# EAGLE schematic contra1575 (EAGLE 7.5.0)
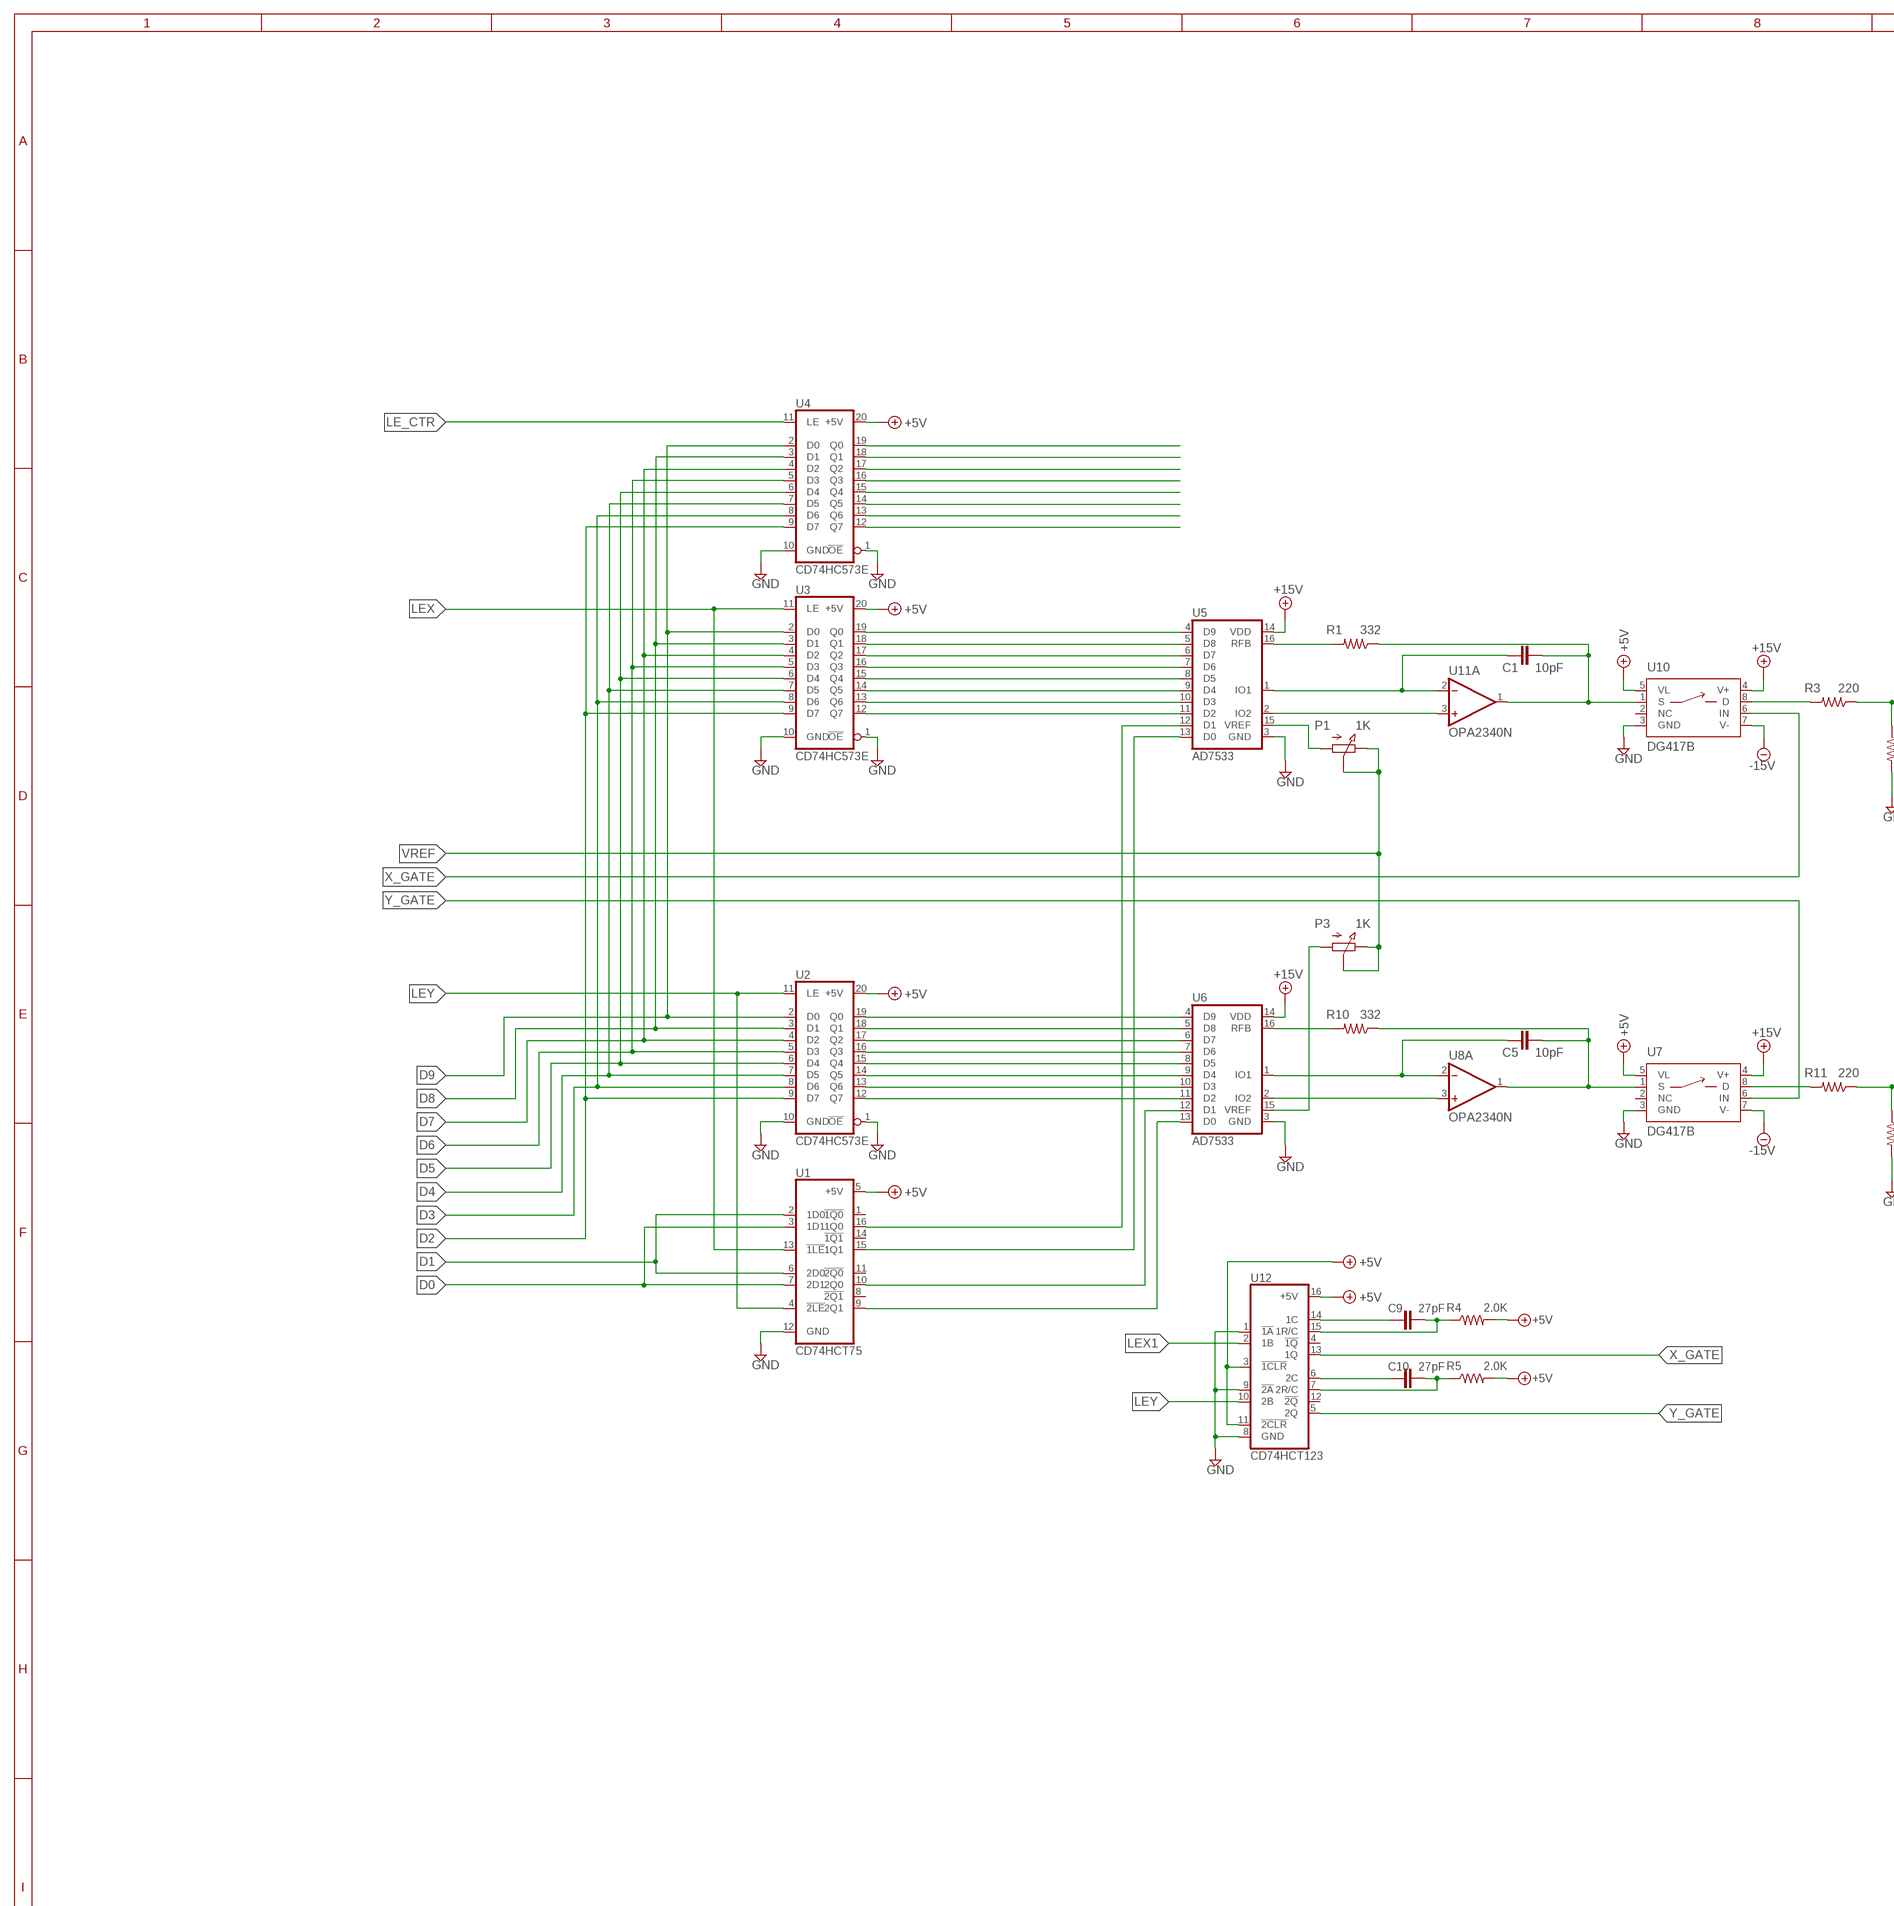
[diagram p0: schematic, sheet 1, part 1 of 2]
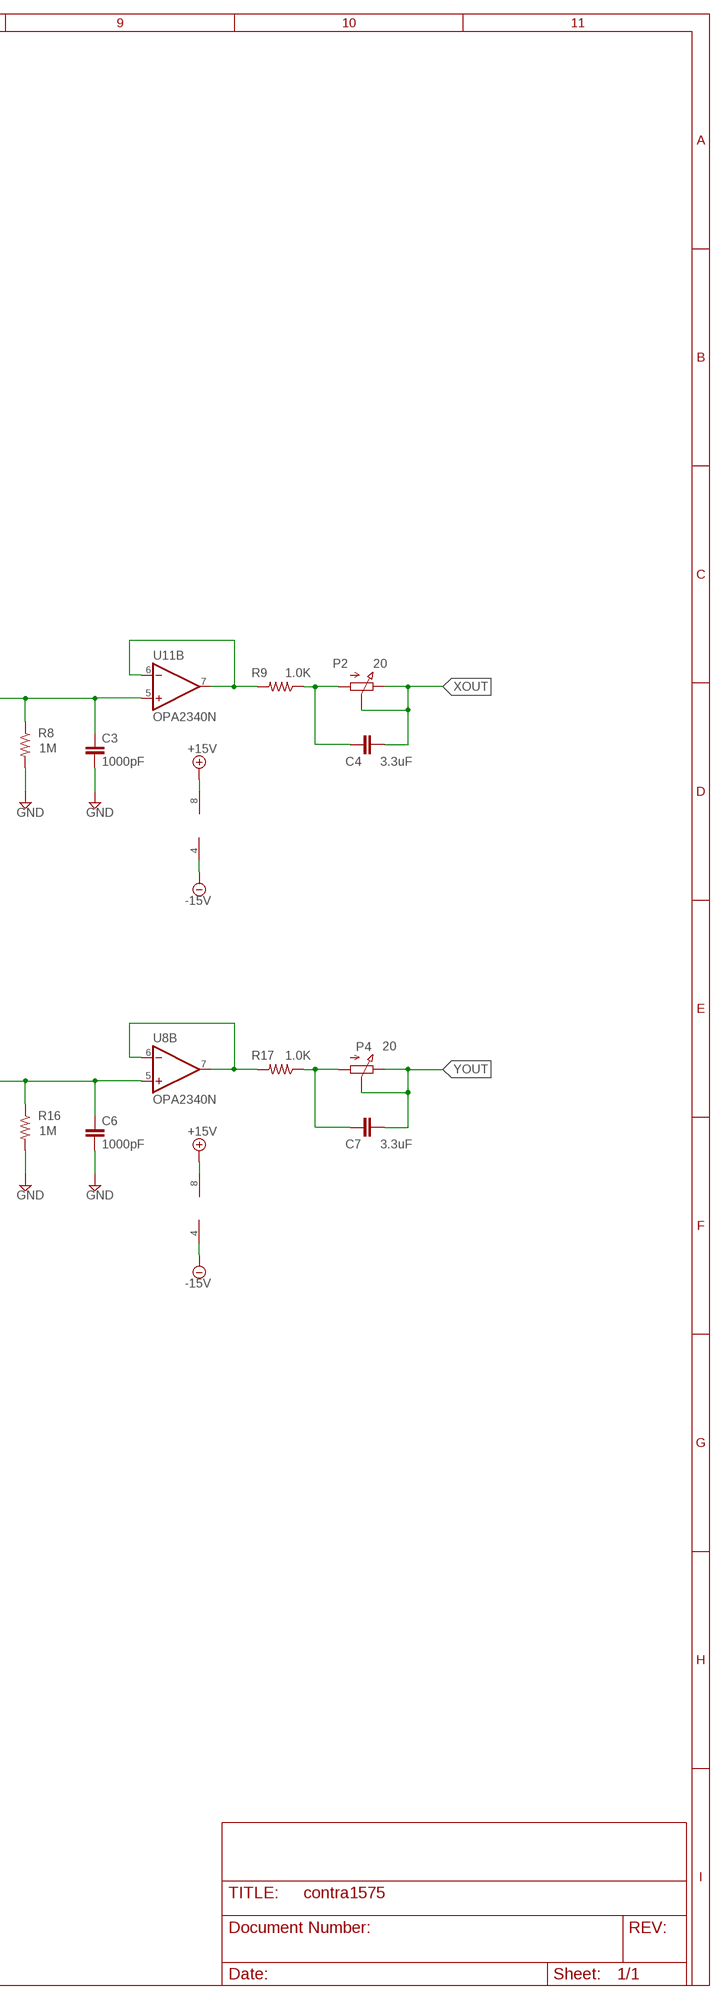
[diagram p1: schematic, sheet 1, part 2 of 2]

## Parts
C1  10pF  C-0.1  [C2.5]
C3  1000pF  C-0.1  [C2.5]
C4  3.3uF  MKS2B043301H00  [MKS2B043301H00]
C5  10pF  C-0.1  [C2.5]
C6  1000pF  C-0.1  [C2.5]
C7  3.3uF  MKS2B043301H00  [MKS2B043301H00]
C9  27pF  C-0.1  [C2.5]
C10  27pF  C-0.1  [C2.5]
P1  1K  POT-3006P  [3006P]
P2  20  POT-3006P  [3006P]
P3  1K  POT-3006P  [3006P]
P4  20  POT-3006P  [3006P]
R1  332  R-1/4WATT  [0207/10]
R3  220  R-1/4WATT  [0207/10]
R4  2.0K  R-1/4WATT  [0207/10]
R5  2.0K  R-1/4WATT  [0207/10]
R8  1M  R-1/4WATT  [0207/10]
R9  1.0K  R-1/4WATT  [0207/10]
R10  332  R-1/4WATT  [0207/10]
R11  220  R-1/4WATT  [0207/10]
R16  1M  R-1/4WATT  [0207/10]
R17  1.0K  R-1/4WATT  [0207/10]
U1  CD74HCT75  [DIP-16]
U2  CD74HC573E  [DIP-20]
U3  CD74HC573E  [DIP-20]
U4  CD74HC573E  [DIP-20]
U5  AD7533  [DIP-16]
U6  AD7533  [DIP-16]
U7  DG417B  [DIP-08]
U8  OPA2340N  [DIP-08]
U10  DG417B  [DIP-08]
U11  OPA2340N  [DIP-08]
U12  CD74HCT123  [DIP-16]

## Nets
+5V: R4.2 R5.2 U1.5(+5V) U2.20(+5V) U3.20(+5V) U4.20(+5V) U7.5(VL) U10.5(VL) U12.3(!1CLR) U12.11(!2CLR) U12.16(+5V)
+15V: U5.14(VDD) U6.14(VDD) U7.4(V+) U8.8(P:V+) U10.4(V+) U11.8(P:V+)
-15V: U7.7(V-) U8.4(P:V-) U10.7(V-) U11.4(P:V-)
D0: U1.3(1D1) U1.7(2D1)
D1: U1.2(1D0) U1.6(2D0)
D2: U2.9(D7) U3.9(D7) U4.9(D7)
D3: U2.8(D6) U3.8(D6) U4.8(D6)
D4: U2.7(D5) U3.7(D5) U4.7(D5)
D5: U2.6(D4) U3.6(D4) U4.6(D4)
D6: U2.5(D3) U3.5(D3) U4.5(D3)
D7: U2.4(D2) U3.4(D2) U4.4(D2)
D8: U2.3(D1) U3.3(D1) U4.3(D1)
D9: U2.2(D0) U3.2(D0) U4.2(D0)
GND: C3.2 C6.2 R8.2 R16.2 U1.12(GND) U2.1(!OE) U2.10(GND) U3.1(!OE) U3.10(GND) U4.1(!OE) U4.10(GND) U5.3(GND) U6.3(GND) U7.3(GND) U10.3(GND) U12.1(!1A) U12.8(GND) U12.9(!2A)
LE_CTR: U4.11(LE)
LEX: U1.13(!1LE) U3.11(LE)
LEX1: U12.2(1B)
LEY: U1.4(!2LE) U2.11(LE)
LEY1: U12.10(2B)
N$1: R9.2 U11.6(B:-IN) U11.7(B:OUT)
N$2: C9.2 R4.1 U12.15(1R/C)
N$3: U1.16(1Q0) U5.12(D1)
N$4: U1.15(1Q1) U5.13(D0)
N$5: C1.1 U5.1(IO1) U11.2(A:-IN)
N$6: U5.2(IO2) U11.3(A:+IN)
N$7: U2.19(Q0) U6.4(D9)
N$8: U2.18(Q1) U6.5(D8)
N$9: U2.17(Q2) U6.6(D7)
N$10: U2.16(Q3) U6.7(D6)
N$11: U2.15(Q4) U6.8(D5)
N$12: U2.14(Q5) U6.9(D4)
N$13: U2.13(Q6) U6.10(D3)
N$14: U2.12(Q7) U6.11(D2)
N$15: U4.12(Q7)
N$16: U4.13(Q6)
N$17: U4.14(Q5)
N$18: U4.15(Q4)
N$19: U4.16(Q3)
N$20: U4.17(Q2)
N$21: U4.18(Q1)
N$22: U4.19(Q0)
N$23: C1.2 R1.1 U10.1(S) U11.1(A:OUT)
N$24: P1.1(A) U5.15(VREF)
N$25: U3.19(Q0) U5.4(D9)
N$26: U3.18(Q1) U5.5(D8)
N$27: U3.17(Q2) U5.6(D7)
N$28: U3.16(Q3) U5.7(D6)
N$29: U3.15(Q4) U5.8(D5)
N$30: U3.14(Q5) U5.9(D4)
N$31: U3.13(Q6) U5.10(D3)
N$32: U3.12(Q7) U5.11(D2)
N$33: C9.1 U12.14(1C)
N$34: R3.2 U10.8(D)
N$35: U1.10(2Q0) U6.12(D1)
N$36: U1.9(2Q1) U6.13(D0)
N$37: C10.2 R5.1 U12.7(2R/C)
N$38: R1.2 U5.16(RFB)
N$40: C4.1 P2.1(A) R9.1
N$42: C3.1 R3.1 R8.1 U11.5(B:+IN)
N$44: C5.2 R10.1 U7.1(S) U8.1(A:OUT)
N$45: C5.1 U6.1(IO1) U8.2(A:-IN)
N$46: U6.2(IO2) U8.3(A:+IN)
N$47: R10.2 U6.16(RFB)
N$48: C10.1 U12.6(2C)
N$49: C6.1 R11.1 R16.1 U8.5(B:+IN)
N$50: R17.2 U8.6(B:-IN) U8.7(B:OUT)
N$51: R11.2 U7.8(D)
N$53: P3.1(A) U6.15(VREF)
N$56: C7.1 P4.1(A) R17.1
VREF: P1.2(S) P1.3(E) P3.2(S) P3.3(E)
X_GATE: U10.6(IN) U12.13(1Q)
XOUT: C4.2 P2.2(S) P2.3(E)
Y_GATE: U7.6(IN) U12.5(2Q)
YOUT: C7.2 P4.2(S) P4.3(E)
Unconnected: U1.1(!1Q0) U1.8(!2Q1) U1.11(!2Q0) U1.14(!1Q1) U7.2(NC) U10.2(NC) U12.4(!1Q) U12.12(!2Q)

## Library data of the parts
C1 C3 C5 C6 C9 C10 = keiths:C-0.1: Through hole radial capacitor. 0.1 inch lead to lead.
C4 C7 = keiths:MKS2B043301H00: Metallized Polyester Capacitor 3.3uF; PN: MKS2B043301H00MSSD
P1 P3 = keiths:POT-3006P: 3006 - Trimpot® Trimming Potentiometer. Clockwise turn moves wiper to pin 3; PN: 3006W-1-102LF
P2 P4 = keiths:POT-3006P: 3006 - Trimpot® Trimming Potentiometer. Clockwise turn moves wiper to pin 3; PN: 3006W-1-200LF
R1 R3-R5 R8-R11 R16 R17 = keiths:R-1/4WATT: Quarter watt through hole resistor.
U1 = keiths:CD74HCT75: dual two bit transparant latch
U2-U4 = keiths:CD74HC573E: Octal Transparent D-Type Latches With 3-State Outputs
U5 U6 = keiths:AD7533: CMOS parallel input 10-Bit Multiplying DAC
U7 U10 = keiths:DG417B: SPST CMOS Analog Switch; PN: DG417BDJ-E3
U8 U11 = keiths:OPA2340: SINGLE-SUPPLY, RAIL-TO-RAIL OP AMPS 5.5MHz; PN: OPA2340PA
U12 = keiths:CD74HCT123: High-Speed CMOS Logic Dual Retriggerable Monostable Multivibrator